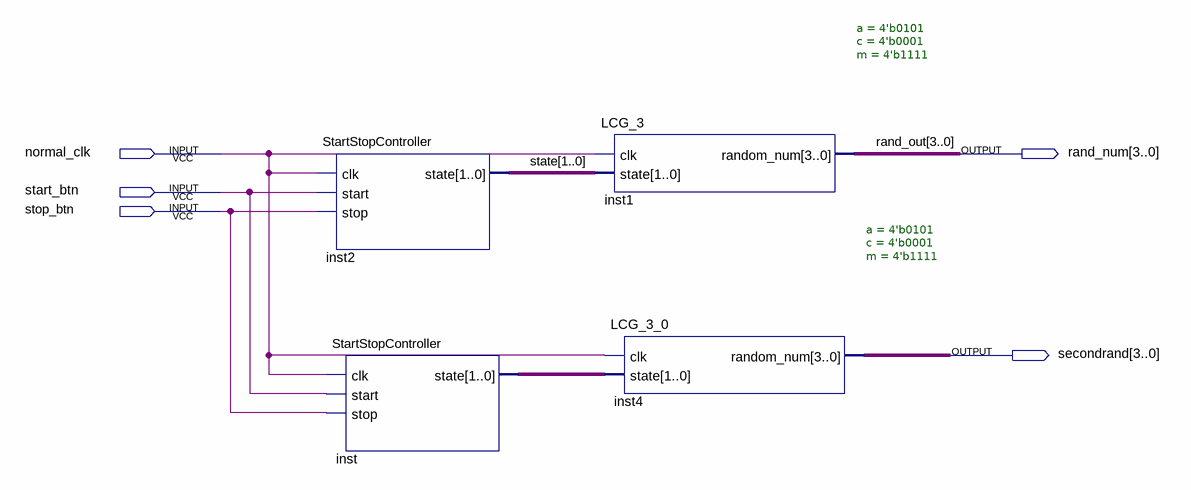
[diagram p0: schematic sheet]
// Quartus schematic Term_05.bdf as structural Verilog: 4 symbols, 5 pins
module Term_05 (
  input  normal_clk,
  input  start_btn,
  input  stop_btn,
  output [3:0] rand_num,
  output [3:0] secondrand
);

  wire [1:0] inst_state, state;

  StartStopController inst2 (.clk(normal_clk), .start(start_btn), .stop(stop_btn), .state(state));
  StartStopController inst (.clk(normal_clk), .start(start_btn), .stop(stop_btn), .state(inst_state));
  LCG_3 #(.a(4'b0101), .c(4'b0001), .m(4'b1111)) inst1 (.clk(normal_clk), .state(state), .random_num(rand_num));
  LCG_3_0 #(.a(4'b0101), .c(4'b0001), .m(4'b1111)) inst4 (
    .clk(normal_clk), .state(inst_state), .random_num(secondrand));

  // Other names for the same wires on the sheet: rand_out[3:0] = rand_num
endmodule
